# EasyEDA schematic Ender 3 control panel.json
TITLE: Ender 3 Control Panel - fiorucci@oasi.asti.it; REV: 1.0; Date: 2023-12-17; Sheet: 1/1; Company: 65397
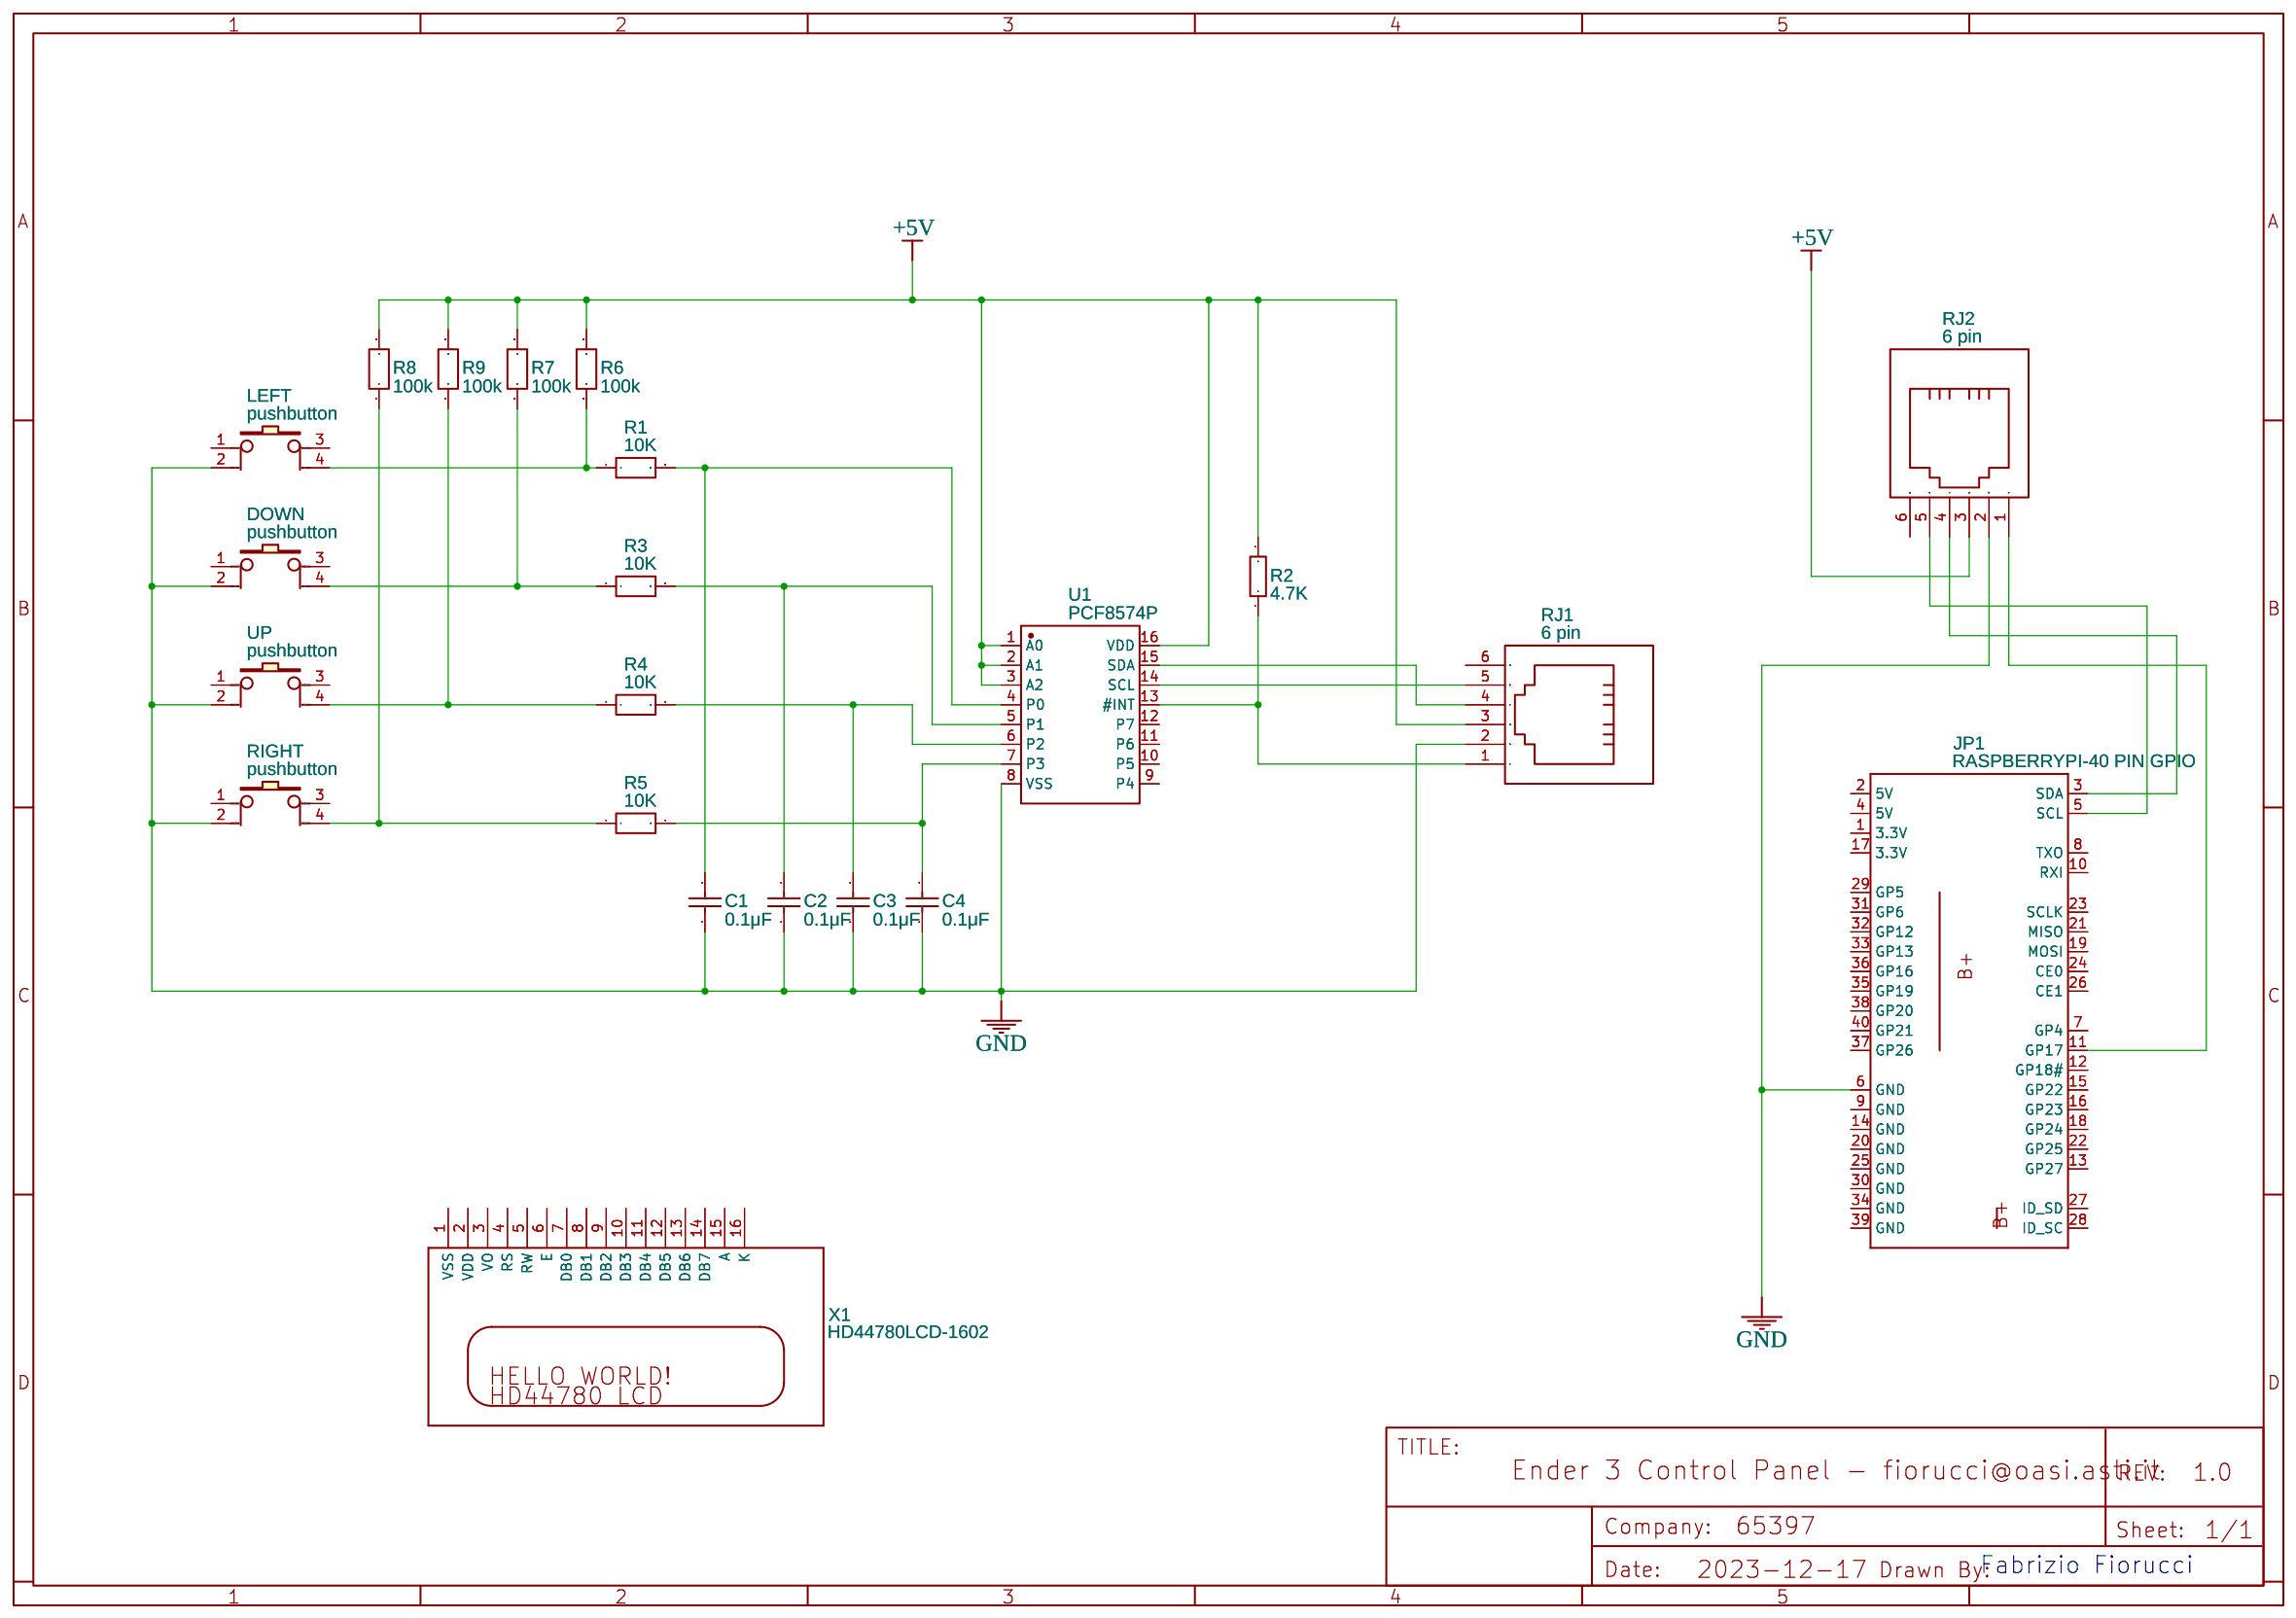
[diagram p0: schematic sheet]

## Parts
C1  0.1μF  [CAP-TH_L6.5-W4.0-P5.00-D1.0]
C2  0.1μF  [CAP-TH_L6.5-W4.0-P5.00-D1.0]
C3  0.1μF  [CAP-TH_L6.5-W4.0-P5.00-D1.0]
C4  0.1μF  [CAP-TH_L6.5-W4.0-P5.00-D1.0]
DOWN  pushbutton  [KEY-TH_4P-L6.0-W6.0-P4.50]
JP1  RASPBERRYPI-40 PIN GPIO  [2X20-SHROUDED]
LEFT  pushbutton  [KEY-TH_4P-L6.0-W6.0-P4.50]
R1  10K  [RES-TH_BD5.0-L15.5-P19.50-D0.8]
R2  4.7K  [RES-TH_BD2.2-L6.5-P10.50-D0.6]
R3  10K  [RES-TH_BD5.0-L15.5-P19.50-D0.8]
R4  10K  [RES-TH_BD5.0-L15.5-P19.50-D0.8]
R5  10K  [RES-TH_BD5.0-L15.5-P19.50-D0.8]
R6  100k  [RES-TH_BD5.0-L15.5-P19.50-D0.8]
R7  100k  [RES-TH_BD5.0-L15.5-P19.50-D0.8]
R8  100k  [RES-TH_BD5.0-L15.5-P19.50-D0.8]
R9  100k  [RES-TH_BD5.0-L15.5-P19.50-D0.8]
RIGHT  pushbutton  [KEY-TH_4P-L6.0-W6.0-P4.50]
RJ1  6 pin  [RJ11-TH_DS1133-S60BPX]
RJ2  6 pin  [RJ11-TH_DS1133-S60BPX]
U1  PCF8574P  [DIP-16_L19.2-W6.6-P2.54-LS7.6-BL]
UP  pushbutton  [KEY-TH_4P-L6.0-W6.0-P4.50]
X1  HD44780LCD-1602  [LCD1602]

## Library data of the parts
C1-C4 = CAPACITOR15NF100V: Supplier: LCSC; Manufacturer: ReliaPro; Manufacturer Part: Capacitor15nf100v; Contributor: LCSC; Supplier Part: C26191
DOWN LEFT RIGHT UP = button6*6*8.5: Supplier Part: C59980; Supplier: LCSC; Manufacturer: ReliaPro; image: http://image.lceda.cn/szlcsc/C59980.jpg
JP1 = RASPBERRYPI-B+-GPIO: Raspberry Pi B+ GPIO Header; Contributor: SparkFun
R1 R3-R9 = RD 3WS 10K J T/B A1: Supplier: LCSC; Supplier Part: C433821; Manufacturer: TyoHM; Contributor: LCSC
R2 = CFR0W4J0472A50: Supplier: LCSC; Manufacturer: UniOhm; Supplier Part: C61297
RJ1 RJ2 = DS1133-S60BPX: Supplier: LCSC; Manufacturer: CONNFLY; Supplier Part: C77859
U1 = PCF8574P: Supplier: LCSC; Supplier Part: C398073; Manufacturer: HGSEMI; Contributor: LCSC
X1 = HD44780LCD-1602: HD44780 LCD; Contributor: Adafruit

## Nets
+5V: R2.2 R6.2 R7.2 R8.2 R9.2 RJ1.3 RJ2.3 U1.1(A0) U1.2(A1) U1.3(A2) U1.16(VDD)
GND: C1.1 C2.1 C3.1 C4.1 DOWN.2 JP1.6(GND) LEFT.2 RIGHT.2 RJ1.2 RJ2.2 U1.8(VSS) UP.2
Net-(C1-2): C1.2 R1.2 U1.4(P0)
Net-(C2-2): C2.2 R3.2 U1.5(P1)
Net-(C3-2): C3.2 R4.2 U1.6(P2)
Net-(C4-2): C4.2 R5.2 U1.7(P3)
Net-(DOWN-4): DOWN.4 R3.1 R7.1
Net-(JP1-3): JP1.3(SDA) RJ2.4
Net-(JP1-5): JP1.5(SCL) RJ2.5
Net-(JP1-11): JP1.11(GP17) RJ2.1
Net-(LEFT-4): LEFT.4 R1.1 R6.1
Net-(R2-1): R2.1 RJ1.1 U1.13(#INT)
Net-(R4-1): R4.1 R9.1 UP.4
Net-(R5-1): R5.1 R8.1 RIGHT.4
Net-(RJ1-4): RJ1.4 U1.15(SDA)
Net-(RJ1-5): RJ1.5 U1.14(SCL)

Not connected (* = marked no-connect by the designer): DOWN 1 3; JP1 1(3.3V) 2(5V) 4(5V) 7(GP4) 8(TXO) 9(GND) 10(RXI) 12(GP18#) 13(GP27) 14(GND) 15(GP22) 16(GP23) 17(3.3V) 18(GP24) 19(MOSI) 20(GND) 21(MISO) 22(GP25) 23(SCLK) 24(CE0) 25(GND) 26(CE1) 27(ID_SD) 28(ID_SC) 29(GP5) 30(GND) 31(GP6) 32(GP12) 33(GP13) 34(GND) 35(GP19) 36(GP16) 37(GP26) 38(GP20) 39(GND) 40(GP21); LEFT 1 3; RIGHT 1 3; RJ1 6; RJ2 6; U1 9(P4) 10(P5) 11(P6) 12(P7); UP 1 3; X1 1(VSS) 2(VDD) 3(VO) 4(RS) 5(RW) 6(E) 7(DB0) 8(DB1) 9(DB2) 10(DB3) 11(DB4) 12(DB5) 13(DB6) 14(DB7) 15(A) 16(K)

## Notes on the sheet
- Fabrizio Fiorucci
